# Altium schematic sheet cw312_xc7a35t_fpga_cfg.SchDoc: Configuration
size Letter; Organization: NewAE Technology Inc.; Address1: 1083 Queen St., Suite 196; Address2: Halifax; Address3: NS; Address4: Canada B3H 0B2; DocumentNumber: .; Revision: .; SheetNumber: 3; SheetTotal: 4; SheetApproved: YES
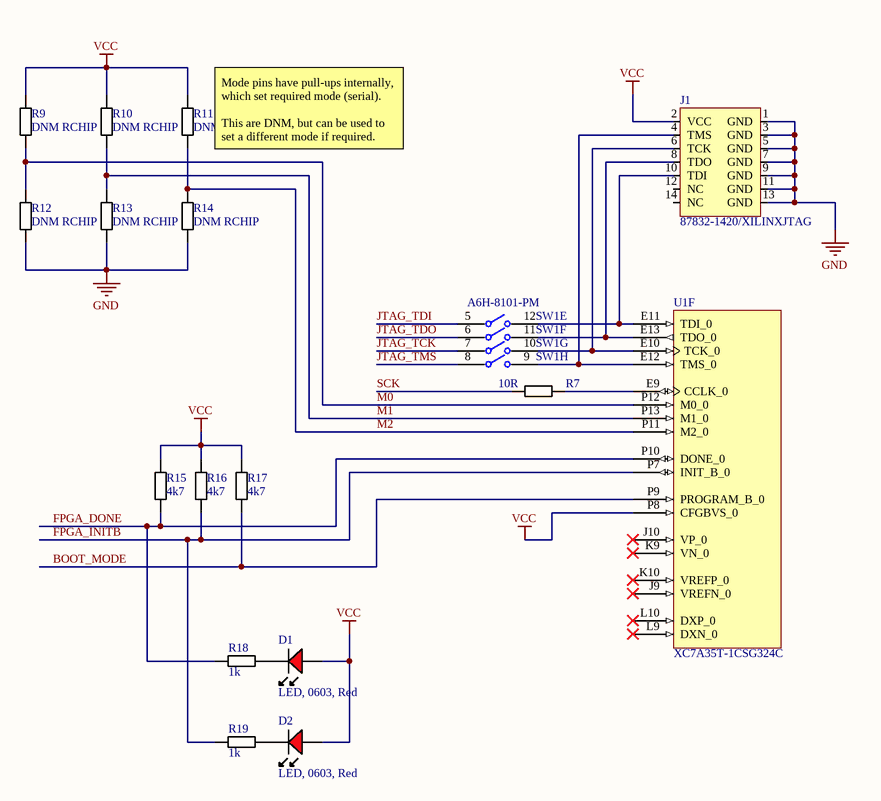
[diagram p0: cw312_xc7a35t_fpga_cfg.SchDoc]

## Parts
D1  LED, 0603, Red  [LED-0603-RED]
D2  LED, 0603, Red  [LED-0603-RED]
J1  87832-1420/XILINXJTAG  [87832-1420]
R7  10R  [RESC1608X55N]
R9  DNM RCHIP  [RESC1608X55N]
R10  DNM RCHIP  [RESC1608X55N]
R11  DNM RCHIP  [RESC1608X55N]
R12  DNM RCHIP  [RESC1608X55N]
R13  DNM RCHIP  [RESC1608X55N]
R14  DNM RCHIP  [RESC1608X55N]
R15  4k7  [RESC1608X55N]
R16  4k7  [RESC1608X55N]
R17  4k7  [RESC1608X55N]
R18  1k  [RESC1608X55N]
R19  1k  [RESC1608X55N]
SW1  A6H-8101-PM  [FP-A6H-8101-PM-MFG]  (parts E,F,G,H of 8)
U1  XC7A35T-1CSG324C  [CSG324]  (part F of 9)

## Nets
GND: J1.1(GND) J1.3(GND) J1.5(GND) J1.7(GND) J1.9(GND) J1.11(GND) J1.13(GND) R12.1 R13.1 R14.1
VCC: D1.A D2.A J1.2(VCC) R9.2 R10.2 R11.2 R15.1 R16.1 R17.1 U1.P8(CFGBVS_0)
BOOT_MODE: R17.2 U1.P9(PROGRAM_B_0)
FPGA_DONE: R15.2 R18.1 U1.P10(DONE_0)
FPGA_INITB: R16.2 R19.1 U1.P7(INIT_B_0)
JTAG_TCK: SW1.7
JTAG_TDI: SW1.5
JTAG_TDO: SW1.6
JTAG_TMS: SW1.8
M0: R9.1 R12.2 U1.P12(M0_0)
M1: R10.1 R13.2 U1.P13(M1_0)
M2: R11.1 R14.2 U1.P11(M2_0)
SCK: R7.1
NetD1_K: D1.K R18.2
NetD2_K: D2.K R19.2
NetJ1_4: J1.4(TMS) SW1.9 U1.E12(TMS_0)
NetJ1_6: J1.6(TCK) SW1.10 U1.E10(TCK_0)
NetJ1_8: J1.8(TDO) SW1.11 U1.E13(TDO_0)
NetJ1_10: J1.10(TDI) SW1.12 U1.E11(TDI_0)
NetR7_2: R7.2 U1.E9(CCLK_0)

Not connected (* = marked no-connect by the designer): J1 12(NC) 14(NC); U1 J9(VREFN_0)* J10(VP_0)* K9(VN_0)* K10(VREFP_0)* L9(DXN_0)* L10(DXP_0)*

## Notes on the sheet
- (near R11) Mode pins have pull-ups internally, which set required mode (serial).
  This are DNM, but can be used to set a different mode if required.
- Title:
- Date:
- Rev:
- Time:
- Project:
- Sheet
- of
- License:
- Copyright © NewAE Technology Inc.
- Approved:
- NewAE.com
- File:

## Library data of the parts
D1 D2 = LEDCHIP_0603_RED: Chip LED, Red; Manufacture 1: Kingbright; Manufacture Part Number 1: APT1608SRCPRV; Component Group: Optical; PP Material Stack: 15; PP Rotation: -90; Part Number: LEDCHIP_0603_RED; Pin Count: 2; Supplier 1: Digi-Key; Supplier Part Number 1: 754-1122-1-ND; Mounting Technology: SMT; Component Kind: Standard; Component Type: Standard
J1 = 87832-1420/XILINXJTAG: Molex 14-pin SMD, JTAG Pinout; Manufacture 1: Molex; Manufacture 1 Part Number: 87832-1420; Supplier 1: Digi-Key; Supplier Part Number 1: WM18641-ND
R7 = RCHIP-10R-0603: 10R res, 0603, 1%, 1/10W; Manufacture 1: Yageo; Manufacture Part Number 1: RC0603FR-0710RL; Component Group: Resistor; Case-EIA: 0603; Case-Metric: 1608; Rated Power: 0.1W; Rated Voltage: 75VDC; Part Number: RCHIP-10R-0603; Footprint: 0603; Pin Count: 2; Supplier 1: Digi-Key; Supplier Part Number 1: 311-10.0HRCT-ND; Value: 10R; Tolerance: 1%; Mounting Technology: SMT; Temperature Range: -55C to 155C; Component Kind: Standard; Component Type: Standard
R9-R14 = RCHIP-DNM-0603: Do Not Mount Resistor; Case-EIA: 0603; Case-Metric: 1608; Part Number: RCHIP-DNM-0603; Component Group: Resistor; Footprint: 0603; Pin Count: 2; Mounting Technology: SMT; Component Kind: Standard; Component Type: Standard
R15-R17 = RCHIP-4K7-0603: 4k7 res, 0603, 1%, 1/10W; Manufacture 1: Yageo; Manufacture Part Number 1: RC0603FR-074K7L; Component Group: Resistor; Case-EIA: 0603; Case-Metric: 1608; Rated Power: 0.1W; Rated Voltage: 75VDC; Part Number: RCHIP-4K7-0603; Footprint: 0603; Pin Count: 2; Supplier 1: Digi-Key; Supplier Part Number 1: 311-4.70KHRCT-ND; Value: 4k7; Tolerance: 1%; Mounting Technology: SMT; Temperature Range: -55C to 155C; Component Kind: Standard; Component Type: Standard
R18 R19 = RCHIP-1K-0603: 1k res, 0603, 1%, 1/10W; Manufacture 1: Yageo; Manufacture Part Number 1: RC0603FR-071KL; Component Group: Resistor; Case-EIA: 0603; Case-Metric: 1608; Rated Power: 0.1W; Rated Voltage: 75VDC; Part Number: RCHIP-1K-0603; Footprint: 0603; Pin Count: 2; Supplier 1: Digi-Key; Supplier Part Number 1: 311-1.00KHRCT-ND; Value: 1k; Tolerance: 1%; Mounting Technology: SMT; Temperature Range: -55C to 155C; Component Kind: Standard; Component Type: Standard
SW1 = CMP-08827-000045-1: SWITCH SLIDE DIP SPST 25MA 24V; Number of Positions: 8; Actuator Type: Slide (Standard); Mechanical Life: 1000Cycles; Pitch: 0.05inch; Washable: No; Radiation Hardening: No; Max Operating Temperature: 70°C; Packaging: Tape and Reel; Max Current Rating: 25mA; Mount: Surface Mount; Voltage Rating (DC): 24V; Package Quantity: 4000; Length: 0.448inch; Depth: 6.7mm; Orientation: Straight; Throw Configuration: SPST; Termination: Gull Wing; Max Voltage Rating (DC): 24V; Series: A6H; Min Operating Temperature: -20°C; Current Rating: 25mA; Electrical Life: 1000Cycles
U1 = CMP-0383-00012-1: Artix-7 FPGA, 210 User I/Os, 0 GTP, 324-Ball BGA, Speed Grade 1, Commercial Grade, Pb-Free; Manufacturer: Xilinx; GTP: 0; Available User I/O: 210; Speed Grades: 1; Logic Cells: 33280; Total Block RAM: 1800 Kb; CMTs: 5; Maximum Distributed RAM: 400 Kb; ComponentLink2URL: http://www.xilinx.com/support/documentation/data_sheets/ds180_7Series_Overview.pdf; ComponentLink2Description: Datasheet; DatasheetVersion: Rev. 1.15; PackageDescription: 324-Ball Wire-Bond Chip-Scale BGA, Body 15 x 15 mm, Pitch 0.8 mm; ComponentLink4URL: http://www.xilinx.com/support/documentation/user_guides/ug475_7Series_Pkg_Pinout.pdf; PackageReference: CSG-324; Mounting Technology: Surface Mount; PackageVersion: Rev. 1.11; ComponentLink1Description: Manufacturer URL; ComponentLink3Description: Pinout; ComponentLink1URL: http://www.xilinx.com/; ComponentLink3URL: http://www.xilinx.com/support/documentation/user_guides/ug475_7Series_Pkg_Pinout.pdf; PartNumber: XC7A35T-1CSG324C; ComponentLink4Description: Package Specification; Operating Temperature Range: Commercial